# Altium schematic sheet Sensors.SchDoc
size A3; Author: Einar / Taulant; Organization: ETML-ES; Address1: Avenue Recordon 1; Address2: 1004 Lausanne; Address3: Switzerland; DocumentNumber: 1; Revision: 1.2; SheetNumber: 4; SheetTotal: 6; Version: A
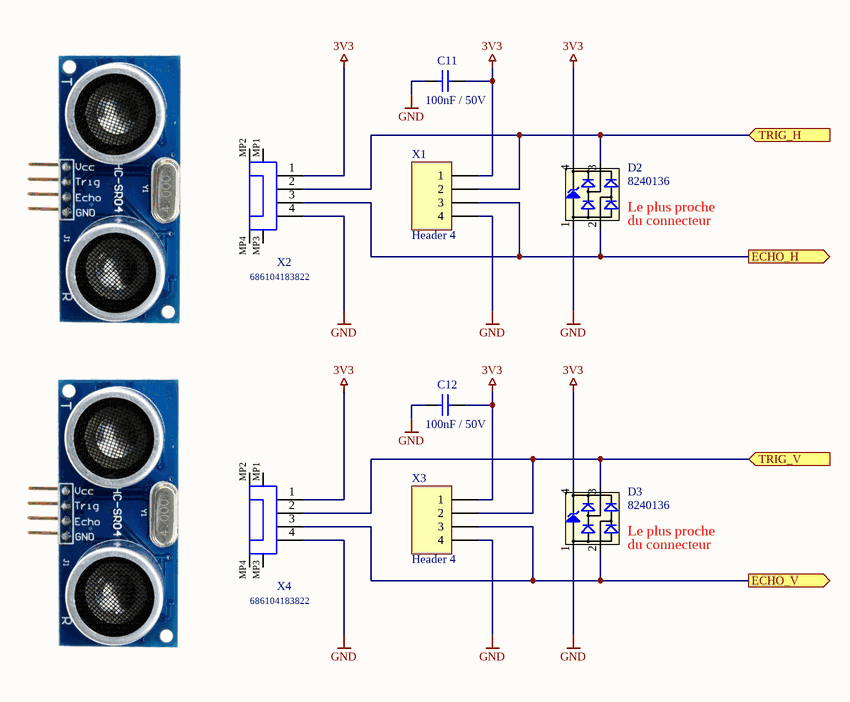
[diagram p0: Sensors.SchDoc]

## Parts
C11  100nF / 50V  [CAPC0805]
C12  100nF / 50V  [CAPC0805]
D2  8240136  [SOT143-4L]
D3  8240136  [SOT143-4L]
X1  Header 4  [Connnector Berg 4P]
X2  686104183822  [686104183822]
X3  Header 4  [Connnector Berg 4P]
X4  686104183822  [686104183822]

## Ports
ECHO_H (out), ECHO_V (out), TRIG_H (in), TRIG_V (in)

## Nets
3V3: C11.2 C12.2 D2.4(VDD) D3.4(VDD) X1.1 X2.1 X3.1 X4.1
GND: C11.1 C12.1 D2.1(GND) D3.1(GND) X1.4 X2.4 X3.4 X4.4
ECHO_H: D2.2(I/O1) X1.3 X2.3 ; port ECHO_H
ECHO_V: D3.2(I/O1) X3.3 X4.3 ; port ECHO_V
TRIG_H: D2.3(I/O2) X1.2 X2.2 ; port TRIG_H
TRIG_V: D3.3(I/O2) X3.2 X4.2 ; port TRIG_V

Not connected (* = marked no-connect by the designer): X2 MP1 MP2 MP3 MP4; X4 MP1 MP2 MP3 MP4

## Notes on the sheet
- (near D2) Le plus proche
- (near D2) du connecteur
- (near D3) Le plus proche
- (near D3) du connecteur
- Fichier :
- a
- Date :
- Heure :
- Version :
- Auteur :
- Modif.
- b
- c
- d
- Projet :
- No :
- Nb feuilles
- Feuille n°
- Chemin :

## Library data of the parts
C11 C12 = Cap: Capacitor; Published: 8-Jun-2000; LatestRevisionDate: 17-Jul-2002; LatestRevisionNote: Re-released for DXP Platform.; PackageReference: RAD-0.3; Publisher: Altium Limited; PackageDescription: Radial Cap, Thru-Hole; 2 Leads; 0.3 in Pin Spacing
D2 D3 = CMP-1486-00002-1: TVS Diode WE-TVS-HS, VRWM=3.3V; Manufacturer: Wuerth Elektronik; Reverse Stand Off Voltage: 3.3V; PartNumber: 8240136; ComponentLink1Description: Manufacturer URL; PackageReference: SOT143-4L; ComponentLink1URL: http://www.we-online.com; ComponentLink2Description: Datasheet; ComponentLink2URL: http://katalog.we-online.de/kataloge/eisos/media/pdf/8240136.pdf; Supplier 1: Digi-Key; Supplier Part Number 1: 732-4472-1-ND
X1 X3 = Header 4: Header, 4-Pin; LatestRevisionDate: 17-Jul-2002; LatestRevisionNote: Re-released for DXP Platform.; Publisher: Altium Limited
X2 X4 = CMP-1502-01500-1: SMT ZIF Connectors WR-FPC, Vertical, Type A, pitch 1 mm, 4 pins; Manufacturer: Wurth Elektronik; Contact Resistance: 30mOhm; Working Voltage: 125VAC; Withstanding Voltage: 250VAC; Contact Design: TypeA; Rated Current: 1A; Pin Number: 4; Pitch: 1mm; Operating Temperature: -25to85degC; Packaging: TapeandReel; Part Number: 686104183822; Orientation: Vertical; Datasheet URL: https://katalog.we-online.de/em/datasheet/686104183822.pdf; Manufacturer URL: http://www.we-online.de; Publisher: WurthElektronik; Package Reference: 686104183822; Mounting Technology: SMT; Supplier 1: Digi-Key; Supplier Part Number 1: 732-11356-1-ND